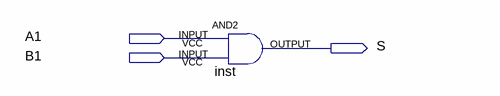
[diagram p0: schematic sheet]
// Quartus schematic TP1_block.bdf as structural Verilog: 1 symbols, 3 pins
module TP1_block (
  input  A1,
  input  B1,
  output S
);

  // AND2 inst has open pins: IN1=A1, IN2=B1, OUT=open
endmodule
